# Altium schematic sheet HD3SS215_PINOUT.SchDoc
size C; SheetNumber: 11; SheetTotal: 14
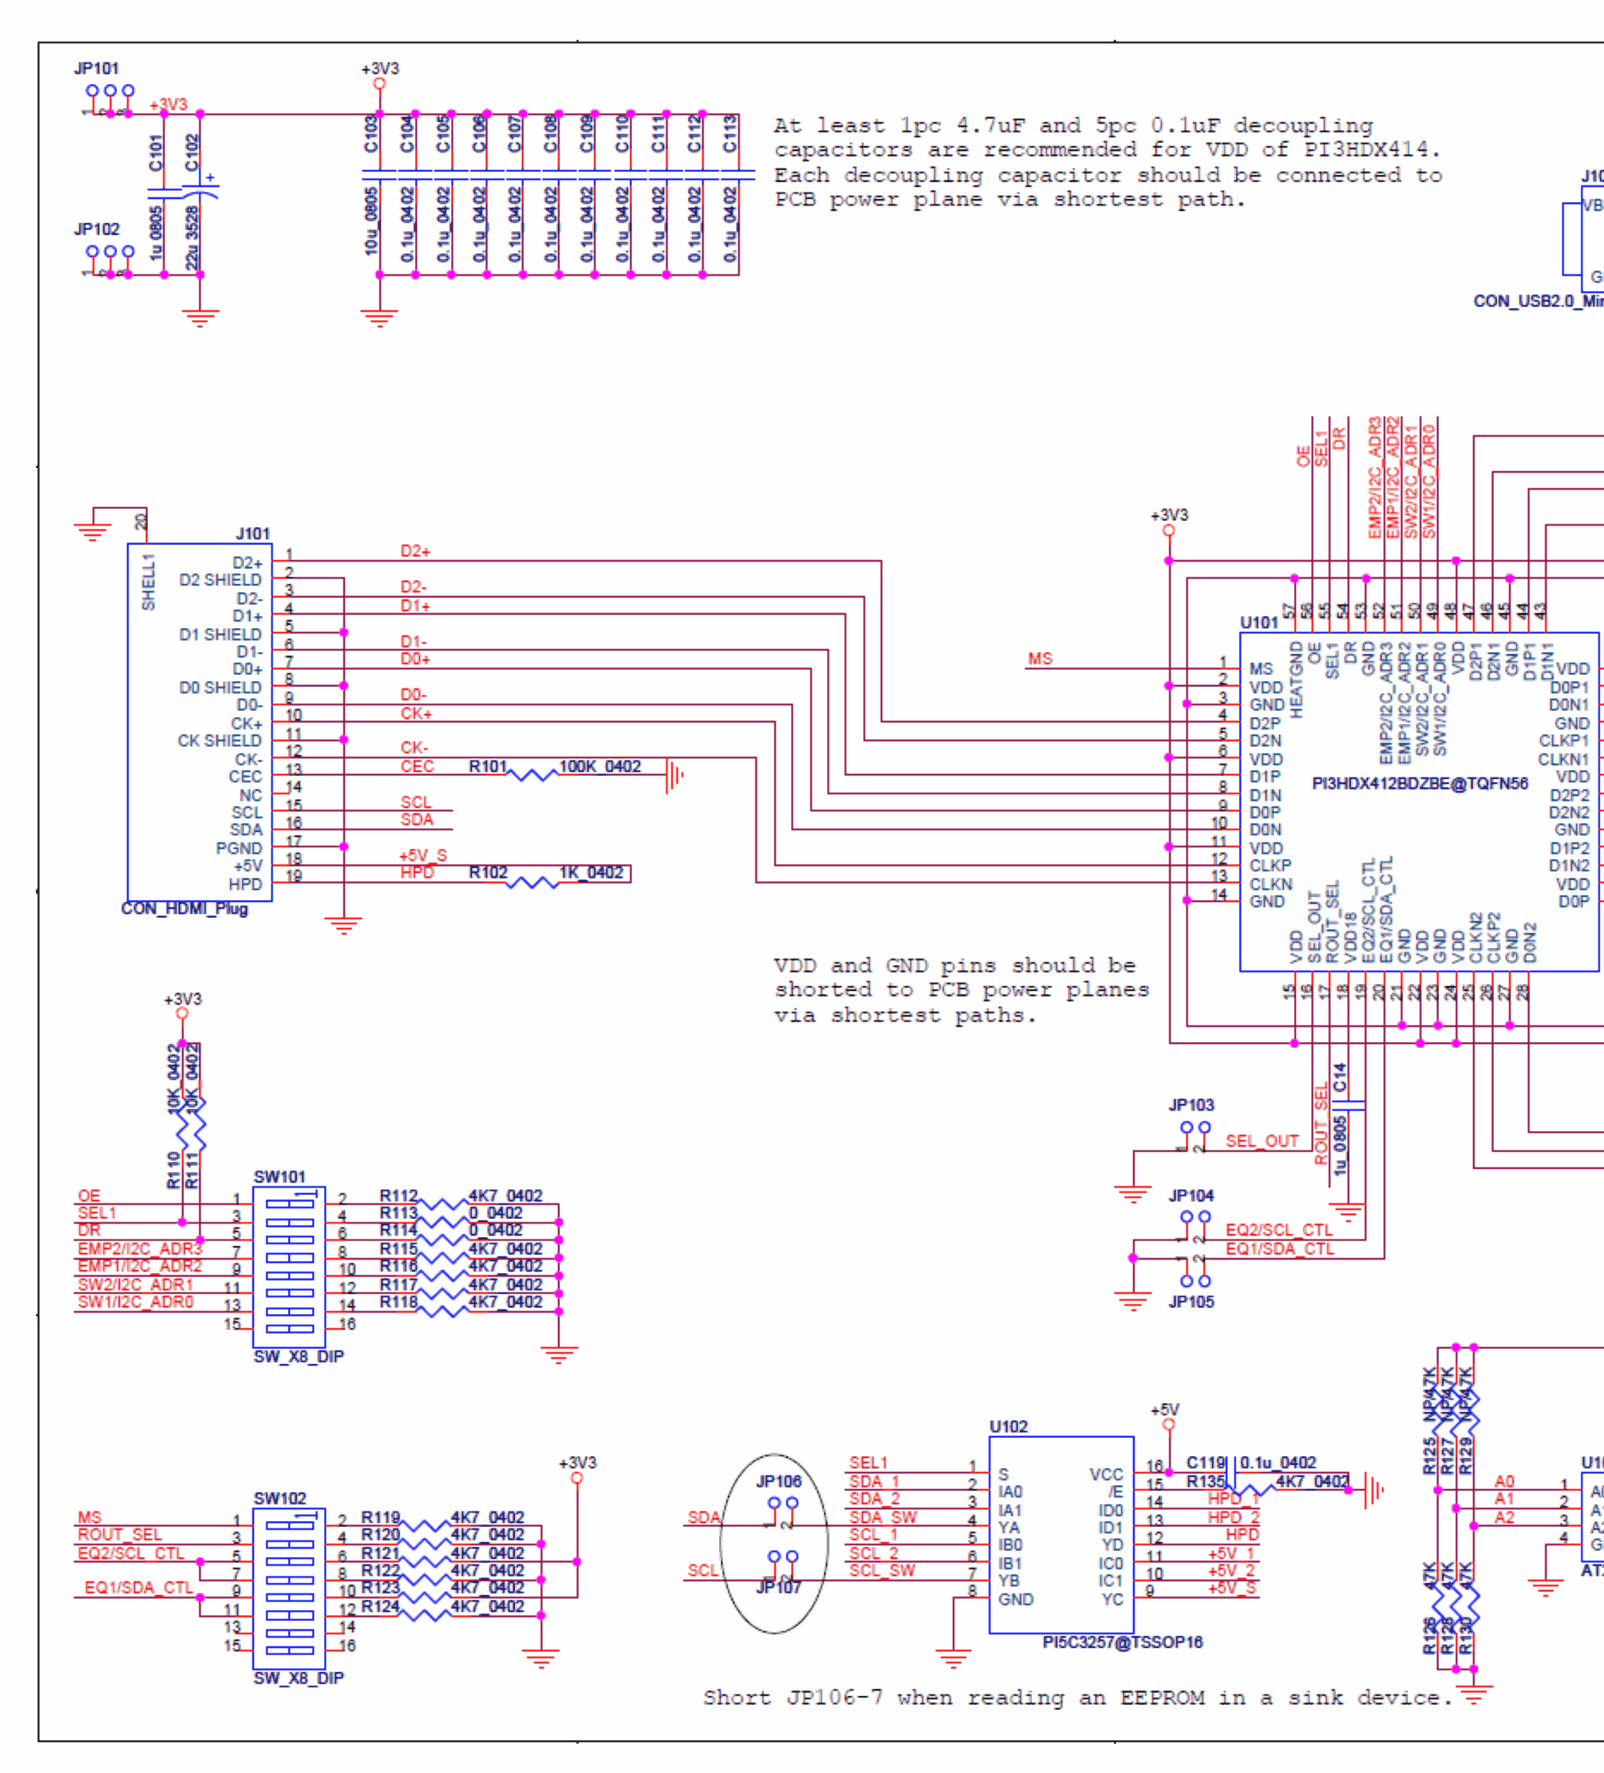
[diagram p0: HD3SS215_PINOUT.SchDoc, top left]
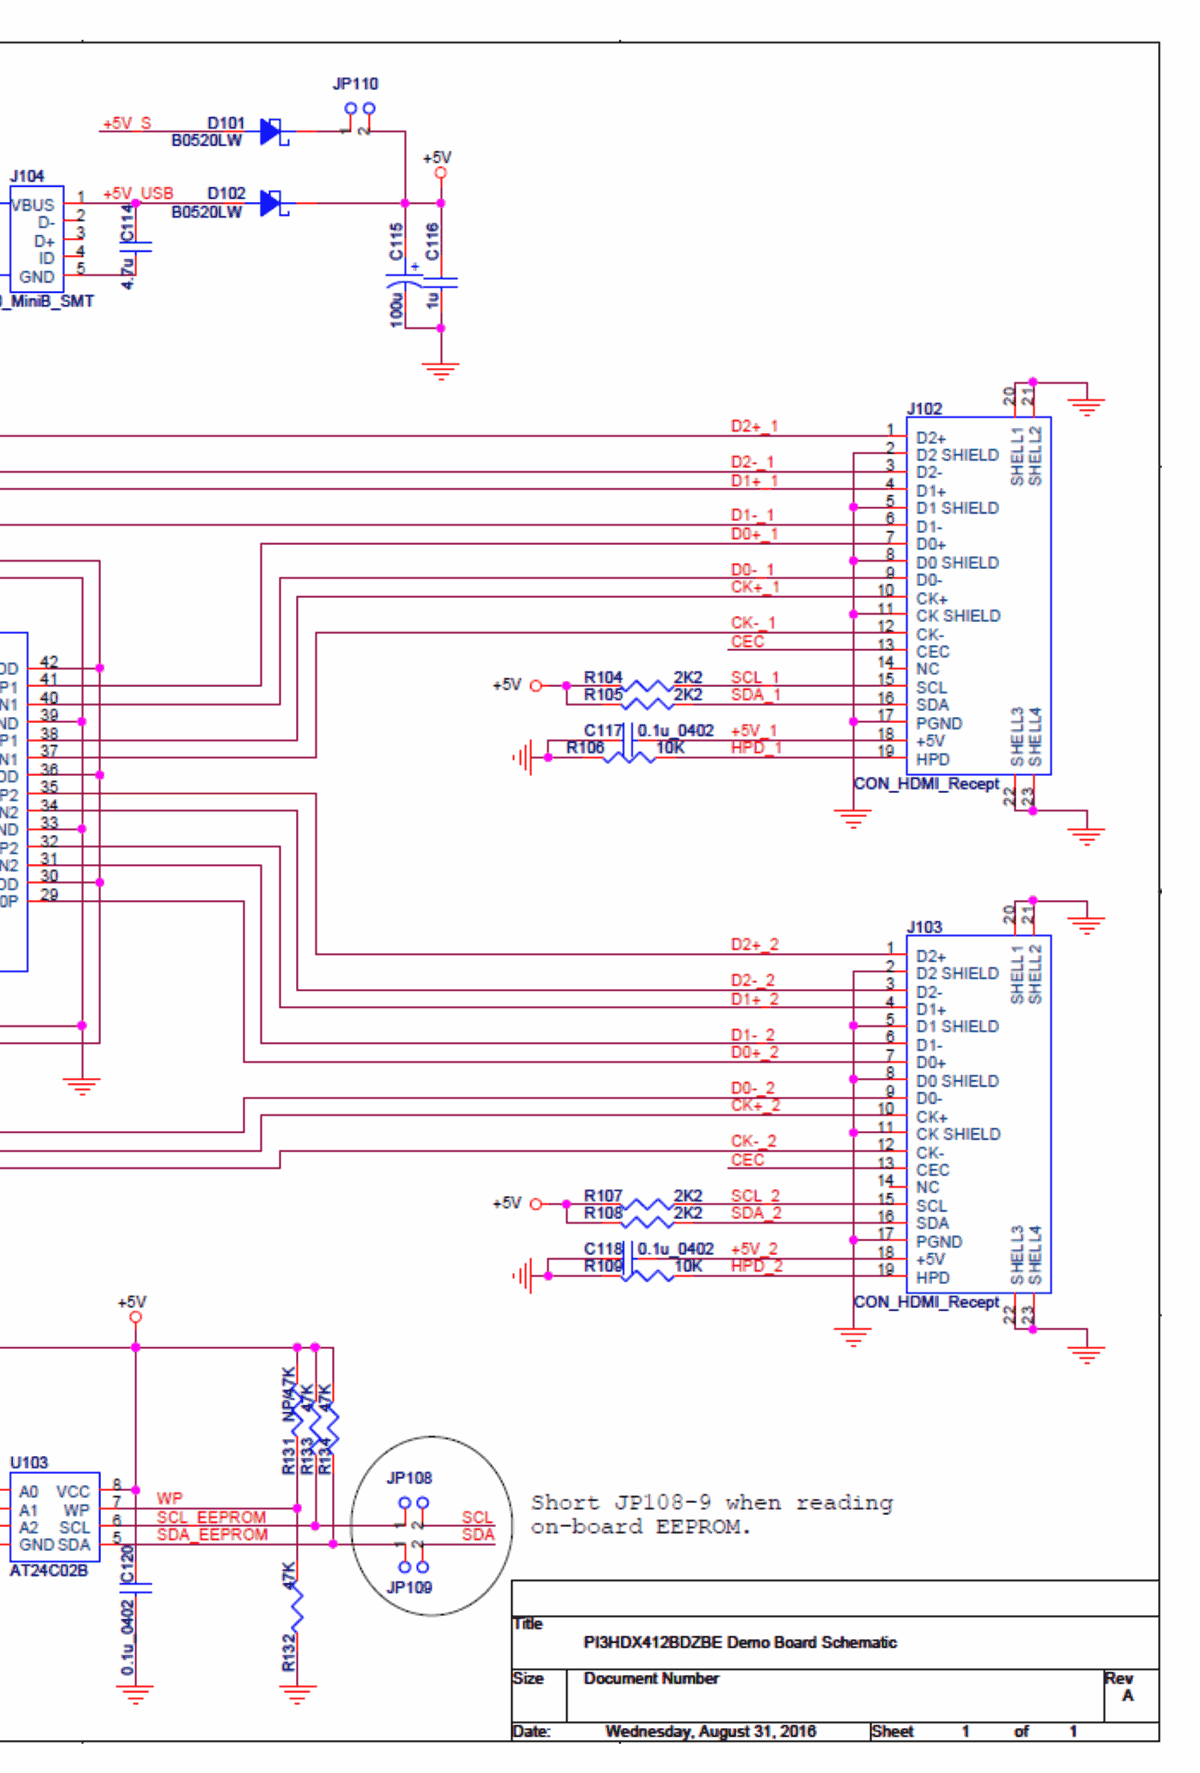
[diagram p1: HD3SS215_PINOUT.SchDoc, top right]
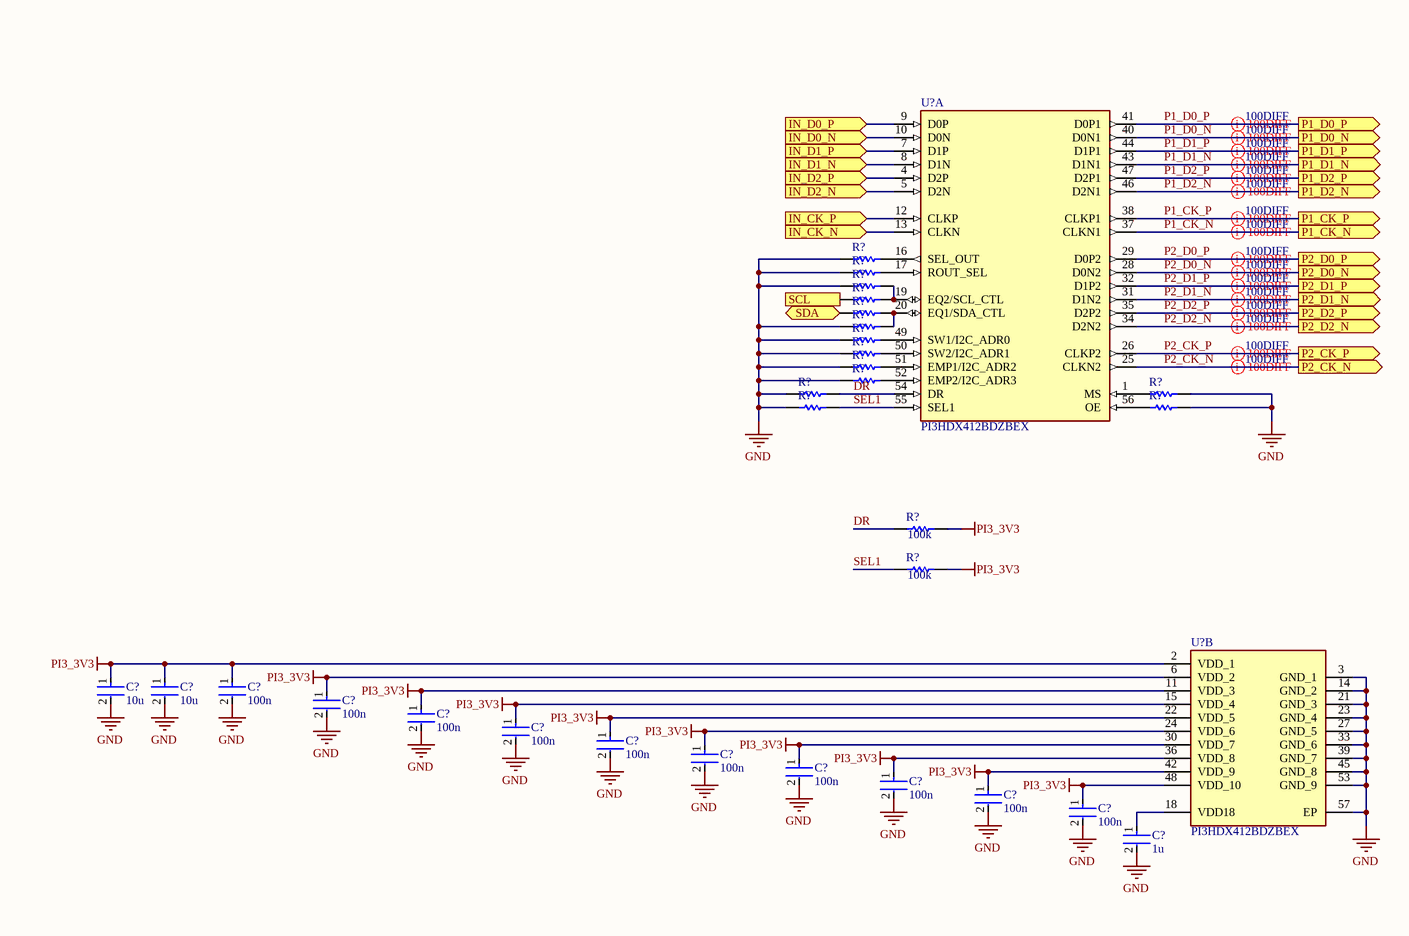
[diagram p2: HD3SS215_PINOUT.SchDoc, bottom left]

## Parts
(Parts that share a designator on the sheet are numbered #1, #2 ... from top to bottom, then left to right.)
C?#1  10u  [FP-0402-L_1_0_0_05-W_0_5-IPC_A]
C?#2  10u  [FP-0402-L_1_0_0_05-W_0_5-IPC_A]
C?#3  100n  [FP-0402-L_1_0_0_05-W_0_5-IPC_A]
C?#4  100n  [FP-0402-L_1_0_0_05-W_0_5-IPC_A]
C?#5  100n  [FP-0402-L_1_0_0_05-W_0_5-IPC_A]
C?#6  100n  [FP-0402-L_1_0_0_05-W_0_5-IPC_A]
C?#7  100n  [FP-0402-L_1_0_0_05-W_0_5-IPC_A]
C?#8  100n  [FP-0402-L_1_0_0_05-W_0_5-IPC_A]
C?#9  100n  [FP-0402-L_1_0_0_05-W_0_5-IPC_A]
C?#10  100n  [FP-0402-L_1_0_0_05-W_0_5-IPC_A]
C?#11  100n  [FP-0402-L_1_0_0_05-W_0_5-IPC_A]
C?#12  100n  [FP-0402-L_1_0_0_05-W_0_5-IPC_A]
C?#13  1u  [FP-0402-L_1_0_0_05-W_0_5-IPC_A]
R?#1  0402 JUMPER  [RESC1005X40X25ML05T05]  (value not drawn)
R?#2  0402 JUMPER  [RESC1005X40X25ML05T05]  (value not drawn)
R?#3  0402 JUMPER  [RESC1005X40X25ML05T05]  (value not drawn)
R?#4  0402 JUMPER  [RESC1005X40X25ML05T05]  (value not drawn)
R?#5  0402 JUMPER  [RESC1005X40X25ML05T05]  (value not drawn)
R?#6  0402 JUMPER  [RESC1005X40X25ML05T05]  (value not drawn)
R?#7  0402 JUMPER  [RESC1005X40X25ML05T05]  (value not drawn)
R?#8  0402 JUMPER  [RESC1005X40X25ML05T05]  (value not drawn)
R?#9  0402 JUMPER  [RESC1005X40X25ML05T05]  (value not drawn)
R?#10  0402 JUMPER  [RESC1005X40X25ML05T05]  (value not drawn)
R?#11  0402 JUMPER  [RESC1005X40X25ML05T05]  (value not drawn)
R?#12  DNP  [RESC1005X40X25ML05T05]  (value not drawn)
R?#13  0402 JUMPER  [RESC1005X40X25ML05T05]  (value not drawn)
R?#14  DNP  [RESC1005X40X25ML05T05]  (value not drawn)
R?#15  100k  [R0603B]
R?#16  100k  [R0603B]
U?#1  PI3HDX412BDZBEX  [QFN50P800X800X84_HS-57N]  (part A of 2)
U?#2  PI3HDX412BDZBEX  [QFN50P800X800X84_HS-57N]  (part B of 2)

## Ports
IN_CK_N (in), IN_CK_P (in), IN_D0_N (in), IN_D0_P (in), IN_D1_N (in), IN_D1_P (in), IN_D2_N (in), IN_D2_P (in), P1_CK_N (out), P1_CK_P (out), P1_D0_N (out), P1_D0_P (out), P1_D1_N (out), P1_D1_P (out), P1_D2_N (out), P1_D2_P (out), P2_CK_N (out), P2_CK_P (out), P2_D0_N (out), P2_D0_P (out), P2_D1_N (out), P2_D1_P (out), P2_D2_N (out), P2_D2_P (out), SCL (in), SDA (bidir)

## Nets
GND: C?#1.2 C?#2.2 C?#3.2 C?#4.2 C?#5.2 C?#6.2 C?#7.2 C?#8.2 C?#9.2 C?#10.2 C?#11.2 C?#12.2 C?#13.2 R?#1.1 R?#2.1 R?#3.1 R?#6.1 R?#7.1 R?#8.1 R?#9.1 R?#10.1 R?#11.1 R?#12.1 R?#13.1 R?#14.1 U?#2.3(GND_1) U?#2.14(GND_2) U?#2.21(GND_3) U?#2.23(GND_4) U?#2.27(GND_5) U?#2.33(GND_6) U?#2.39(GND_7) U?#2.45(GND_8) U?#2.53(GND_9) U?#2.57(EP)
PI3_3V3: C?#1.1 C?#2.1 C?#3.1 C?#4.1 C?#5.1 C?#6.1 C?#7.1 C?#8.1 C?#9.1 C?#10.1 C?#11.1 C?#12.1 R?#15.1 R?#16.1 U?#2.2(VDD_1) U?#2.6(VDD_2) U?#2.11(VDD_3) U?#2.15(VDD_4) U?#2.22(VDD_5) U?#2.24(VDD_6) U?#2.30(VDD_7) U?#2.36(VDD_8) U?#2.42(VDD_9) U?#2.48(VDD_10)
DR: R?#11.2 R?#15.2 U?#1.54(DR)
IN_CK_N: U?#1.13(CLKN) ; port IN_CK_N
IN_CK_P: U?#1.12(CLKP) ; port IN_CK_P
IN_D0_N: U?#1.10(D0N) ; port IN_D0_N
IN_D0_P: U?#1.9(D0P) ; port IN_D0_P
IN_D1_N: U?#1.8(D1N) ; port IN_D1_N
IN_D1_P: U?#1.7(D1P) ; port IN_D1_P
IN_D2_N: U?#1.5(D2N) ; port IN_D2_N
IN_D2_P: U?#1.4(D2P) ; port IN_D2_P
P1_CK_N: U?#1.37(CLKN1) ; port P1_CK_N
P1_CK_P: U?#1.38(CLKP1) ; port P1_CK_P
P1_D0_N: U?#1.40(D0N1) ; port P1_D0_N
P1_D0_P: U?#1.41(D0P1) ; port P1_D0_P
P1_D1_N: U?#1.43(D1N1) ; port P1_D1_N
P1_D1_P: U?#1.44(D1P1) ; port P1_D1_P
P1_D2_N: U?#1.46(D2N1) ; port P1_D2_N
P1_D2_P: U?#1.47(D2P1) ; port P1_D2_P
P2_CK_N: U?#1.25(CLKN2) ; port P2_CK_N
P2_CK_P: U?#1.26(CLKP2) ; port P2_CK_P
P2_D0_N: U?#1.28(D0N2) ; port P2_D0_N
P2_D0_P: U?#1.29(D0P2) ; port P2_D0_P
P2_D1_N: U?#1.31(D1N2) ; port P2_D1_N
P2_D1_P: U?#1.32(D1P2) ; port P2_D1_P
P2_D2_N: U?#1.34(D2N2) ; port P2_D2_N
P2_D2_P: U?#1.35(D2P2) ; port P2_D2_P
SCL: R?#4.1 ; port SCL
SDA: R?#5.1 ; port SDA
SEL1: R?#12.2 R?#16.2 U?#1.55(SEL1)
NetC?#13_1: C?#13.1 U?#2.18(VDD18)
NetR?#1_2: R?#1.2 U?#1.16(SEL_OUT)
NetR?#2_2: R?#2.2 U?#1.17(ROUT_SEL)
NetR?#3_2: R?#3.2 R?#4.2 U?#1.19(EQ2/SCL_CTL)
NetR?#5_2: R?#5.2 R?#6.2 U?#1.20(EQ1/SDA_CTL)
NetR?#7_2: R?#7.2 U?#1.49(SW1/I2C_ADR0)
NetR?#8_2: R?#8.2 U?#1.50(SW2/I2C_ADR1)
NetR?#9_2: R?#9.2 U?#1.51(EMP1/I2C_ADR2)
NetR?#10_2: R?#10.2 U?#1.52(EMP2/I2C_ADR3)
NetR?#13_2: R?#13.2 U?#1.1(MS)
NetR?#14_2: R?#14.2 U?#1.56(OE)

## Layout directives
differential pair; differential pair class 100DIFF: P1_CK_N, P1_CK_P, P1_D0_N, P1_D0_P, P1_D1_N, P1_D1_P, P1_D2_N, P1_D2_P, P2_CK_N, P2_CK_P, P2_D0_N, P2_D0_P, P2_D1_N, P2_D1_P, P2_D2_N, P2_D2_P

## Library data of the parts
C?#1-C?#13 = CMP-001-00058-1: LARGE PADS, 0402 CAP, CHANGE COMMENT TO MATCH REAL P/N; Capacitor Type: Ceramic; Min Operating Temperature: -55°C; Mounting Technology: Surface Mount; Pins: 2; Case/Package: 0402; RoHS Compliant: Yes; Max Operating Temperature: 85°C
R?#1-R?#14 = CMP-009-00118-2: READ THE NAME; Pins: 2; Component Type: Standard; Design Item ID: CMP-009-00206-2; Source: 0402jump.SchLib
R?#15 R?#16 = CMP-009-00002-14: Resistor
U?#1 U?#2 = CMP-015-00020-1: Analog Multiplexer Single 1: 2 56-Pin TQFN EP T/R / IC HDMI SW 1: 2 1.4B 56TQFN; Min Supply Voltage: 3V; Max Supply Voltage: 3.6V; Max Operating Temperature: 85°C; Mounting Technology: Surface Mount; Min Operating Temperature: -40°C; Pins: 56